# Altium schematic sheet Schematic_Altium.schdoc
size 279 x 143 mm
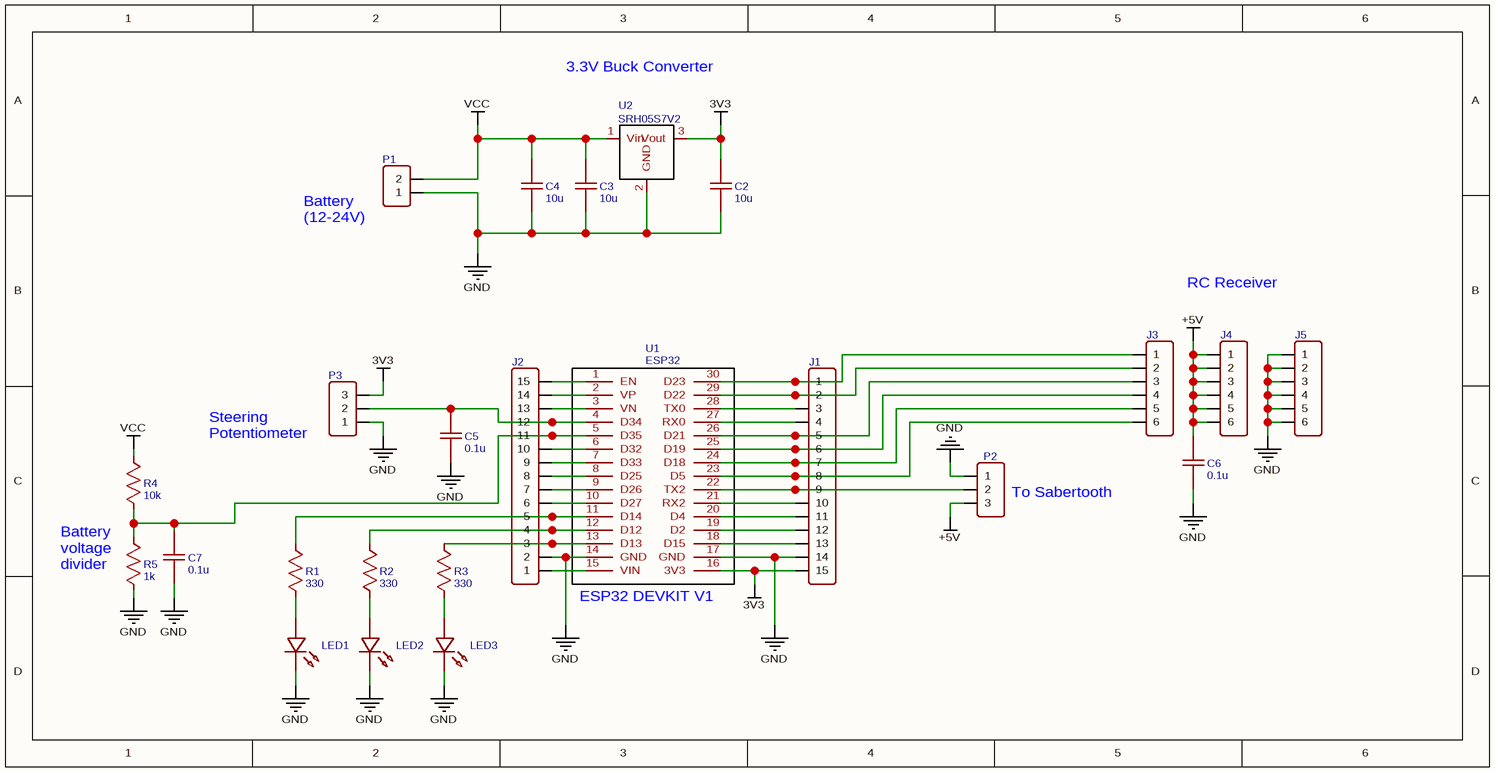
[diagram p0: Schematic_Altium.schdoc]

## Parts
C2  10u  [C1206]
C3  10u  [C1206]
C4  10u  [C1206]
C5  0.1u  [C1206]
C6  0.1u  [C1206]
C7  0.1u  [C1206]
J1  HDR-M-2.54_1x15  [HDR-M-2.54_1X15]  (value not drawn)
J2  HDR-M-2.54_1x15  [HDR-M-2.54_1X15]  (value not drawn)
J3  HDR-M-2.54_1x6  [HDR-M-2.54_1X6]  (value not drawn)
J4  HDR-M-2.54_1x6  [HDR-M-2.54_1X6]  (value not drawn)
J5  HDR-M-2.54_1x6  [HDR-M-2.54_1X6]  (value not drawn)
LED1  LED-TH-3mm_R  [LED-TH_BD3.0_RED]  (value not drawn)
LED2  LED-TH-3mm_R  [LED-TH_BD3.0_RED]  (value not drawn)
LED3  LED-TH-3mm_R  [LED-TH_BD3.0_RED]  (value not drawn)
P1  CONN-TH_2P-P5.00  [CONN-TH_2P-P5.00]  (value not drawn)
P2  CONN-TH_3P-P5.00  [CONN-TH_3P-P5.08]  (value not drawn)
P3  CONN-TH_3P-P5.00  [CONN-TH_3P-P5.08]  (value not drawn)
R1  330  [R1206]
R2  330  [R1206]
R3  330  [R1206]
R4  10k  [R1206]
R5  1k  [R1206]
U1  ESP32  [ESP32]
U2  SRH05S7V2  [SIP3]

## Nets
3V3: C2.2 J1.15 P3.3 U1.16(3V3) U2.3(Vout)
+5V: C6.2 J4.1 J4.2 J4.3 J4.4 J4.5 J4.6 P2.3
GND: C2.1 C3.1 C4.1 C5.1 C6.1 C7.1 J1.14 J2.2 J5.1 J5.2 J5.3 J5.4 J5.5 J5.6 LED1.2 LED2.2 LED3.2 P1.1 P2.1 P3.1 R5.1 U1.14(GND) U1.17(GND) U2.2(GND)
VCC: C3.2 C4.2 P1.2 R4.2 U2.1(Vin)
NetC5_2: C5.2 J2.12 P3.2 U1.4(D34)
NetC7_2: C7.2 J2.11 R4.1 R5.2 U1.5(D35)
NetJ1_1: J1.1 J3.1 U1.30(D23)
NetJ1_2: J1.2 J3.2 U1.29(D22)
NetJ1_3: J1.3 U1.28(TX0)
NetJ1_4: J1.4 U1.27(RX0)
NetJ1_5: J1.5 J3.3 U1.26(D21)
NetJ1_6: J1.6 J3.4 U1.25(D19)
NetJ1_7: J1.7 J3.5 U1.24(D18)
NetJ1_8: J1.8 J3.6 U1.23(D5)
NetJ1_9: J1.9 P2.2 U1.22(TX2)
NetJ1_10: J1.10 U1.21(RX2)
NetJ1_11: J1.11 U1.20(D4)
NetJ1_12: J1.12 U1.19(D2)
NetJ1_13: J1.13 U1.18(D15)
NetJ2_1: J2.1 U1.15(VIN)
NetJ2_3: J2.3 R3.2 U1.13(D13)
NetJ2_4: J2.4 R2.2 U1.12(D12)
NetJ2_5: J2.5 R1.2 U1.11(D14)
NetJ2_6: J2.6 U1.10(D27)
NetJ2_7: J2.7 U1.9(D26)
NetJ2_8: J2.8 U1.8(D25)
NetJ2_9: J2.9 U1.7(D33)
NetJ2_10: J2.10 U1.6(D32)
NetJ2_13: J2.13 U1.3(VN)
NetJ2_14: J2.14 U1.2(VP)
NetJ2_15: J2.15 U1.1(EN)
NetLED1_1: LED1.1 R1.1
NetLED2_1: LED2.1 R2.1
NetLED3_1: LED3.1 R3.1

## Notes on the sheet
- 3.3V Buck Converter
- (near P1) Battery
  (12-24V)
- RC Receiver
- Steering
  Potentiometer
- Battery
  voltage
  divider
- (near P2) To Sabertooth
- (in symbol ESP32) ESP32 DEVKIT V1

## Library data of the parts
C2-C4 = 10u: nameAlias: Value(F); Contributor: LCEDA_Lib; BOM_Supplier Part: 1276-6736-1-ND; BOM_Supplier: Digi-Key; spicePre: C; spiceSymbolName: C_1206_US
C5-C7 = 0.1u: nameAlias: Value(F); Contributor: LCEDA_Lib; spicePre: C; spiceSymbolName: C_1206_US
J1 J2 = HDR-M-2.54_1x15: Contributor: LCEDA_Lib; BOM_Supplier Part: C124373; BOM_Supplier: LCSC; spicePre: J; spiceSymbolName: HDR-M-2.54_1x15
J3-J5 = HDR-M-2.54_1x6: Contributor: LCEDA_Lib; BOM_Supplier Part: C190819; BOM_Supplier: LCSC; spicePre: J; spiceSymbolName: HDR-M-2.54_1x6
LED1-LED3 = LED-TH-3mm_R: BOM_Manufacturer: EVERLIGHT(台湾亿光); BOM_Manufacturer Part: 204-10SDRD/S530-A3-L; Contributor: LCEDA_Lib; BOM_Supplier Part: C84774; BOM_Supplier: LCSC; spicePre: L; spiceSymbolName: LED-TH-3mm_R
P1 = CONN-TH_2P-P5.00: Contributor: LCEDA_Lib; BOM_Supplier: LCSC; spicePre: P; spiceSymbolName: CONN-TH_2P-P5.00
P2 P3 = CONN-TH_3P-P5.00: Contributor: LCEDA_Lib; BOM_Supplier: LCSC; spicePre: P; spiceSymbolName: CONN-TH_3P-P5.00
R1-R3 = 330: nameAlias: Value(Ω); Contributor: LCEDA_Lib; spicePre: R; spiceSymbolName: R_1206_US
R4 = 10k: nameAlias: Value(Ω); Contributor: LCEDA_Lib; spicePre: R; spiceSymbolName: R_1206_US
R5 = 1k: nameAlias: Value(Ω); Contributor: LCEDA_Lib; spicePre: R; spiceSymbolName: R_1206_US
U1 = ESP32: Contributor: philipp.maack; spicePre: U
U2 = SRH05S7V2: BOM_Manufacturer: XP Power; Contributor: AleksejsSkorodumovs; BOM_Manufacturer Part: SRH05S7V2; BOM_Supplier: RS-Online; BOM_Supplier Part: 174-4675; link: https://uk.rs-online.com/web/p/switching-regulators/1744675/; spicePre: U; spiceSymbolName: SRH05S7V2